# EAGLE schematic BlinkyTile (EAGLE 7.1.0)
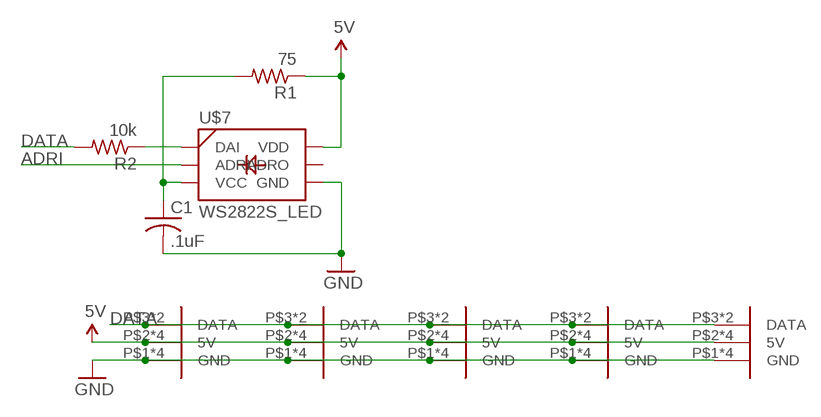
[diagram p0: schematic, sheet 1]

## Parts
C1  .1uF  C-USC0603  [C0603]
R1  75  R-US_R0603  [R0603]
R2  10k  R-US_R0603  [R0603]
U$2  D_EDGESLOT  [D_EDGE_SLOT]
U$3  D_EDGESLOT  [D_EDGE_SLOT]
U$4  D_EDGESLOT  [D_EDGE_SLOT]
U$5  D_EDGESLOT  [D_EDGE_SLOT]
U$6  D_EDGESLOT  [D_EDGE_SLOT]
U$7  WS2822S_LED  [WS2822S_LED]

## Nets
5V: R1.1 U$2.P$2(5V) U$2.P$4(5V) U$2.P$7(5V) U$2.P$9(5V) U$3.P$2(5V) U$3.P$4(5V) U$3.P$7(5V) U$3.P$9(5V) U$4.P$2(5V) U$4.P$4(5V) U$4.P$7(5V) U$4.P$9(5V) U$5.P$2(5V) U$5.P$4(5V) U$5.P$7(5V) U$5.P$9(5V) U$6.P$2(5V) U$6.P$4(5V) U$6.P$7(5V) U$6.P$9(5V) U$7.6(VDD)
ADRI: U$7.2(ADRI)
DATA: R2.2 U$2.P$3(DATA) U$2.P$8(DATA) U$3.P$3(DATA) U$3.P$8(DATA) U$4.P$3(DATA) U$4.P$8(DATA) U$5.P$3(DATA) U$5.P$8(DATA) U$6.P$3(DATA) U$6.P$8(DATA)
GND: C1.2 U$2.P$1(GND) U$2.P$5(GND) U$2.P$6(GND) U$2.P$10(GND) U$3.P$1(GND) U$3.P$5(GND) U$3.P$6(GND) U$3.P$10(GND) U$4.P$1(GND) U$4.P$5(GND) U$4.P$6(GND) U$4.P$10(GND) U$5.P$1(GND) U$5.P$5(GND) U$5.P$6(GND) U$5.P$10(GND) U$6.P$1(GND) U$6.P$5(GND) U$6.P$6(GND) U$6.P$10(GND) U$7.4(GND)
N$1: C1.1 R1.2 U$7.3(VCC)
N$2: R2.1 U$7.1(DAI)
Unconnected: U$7.5(ADRO)

## Library data of the parts
C1 = adafruit:C-US: CAPACITOR, American symbol
R1 R2 = adafruit:R-US_: RESISTOR, American symbol
U$2-U$6 = dodocohedreled:D_EDGE
U$7 = blinkinlabs:WS2822S_LED